# Altium schematic sheet 08.SchDoc
size 246 x 182 mm
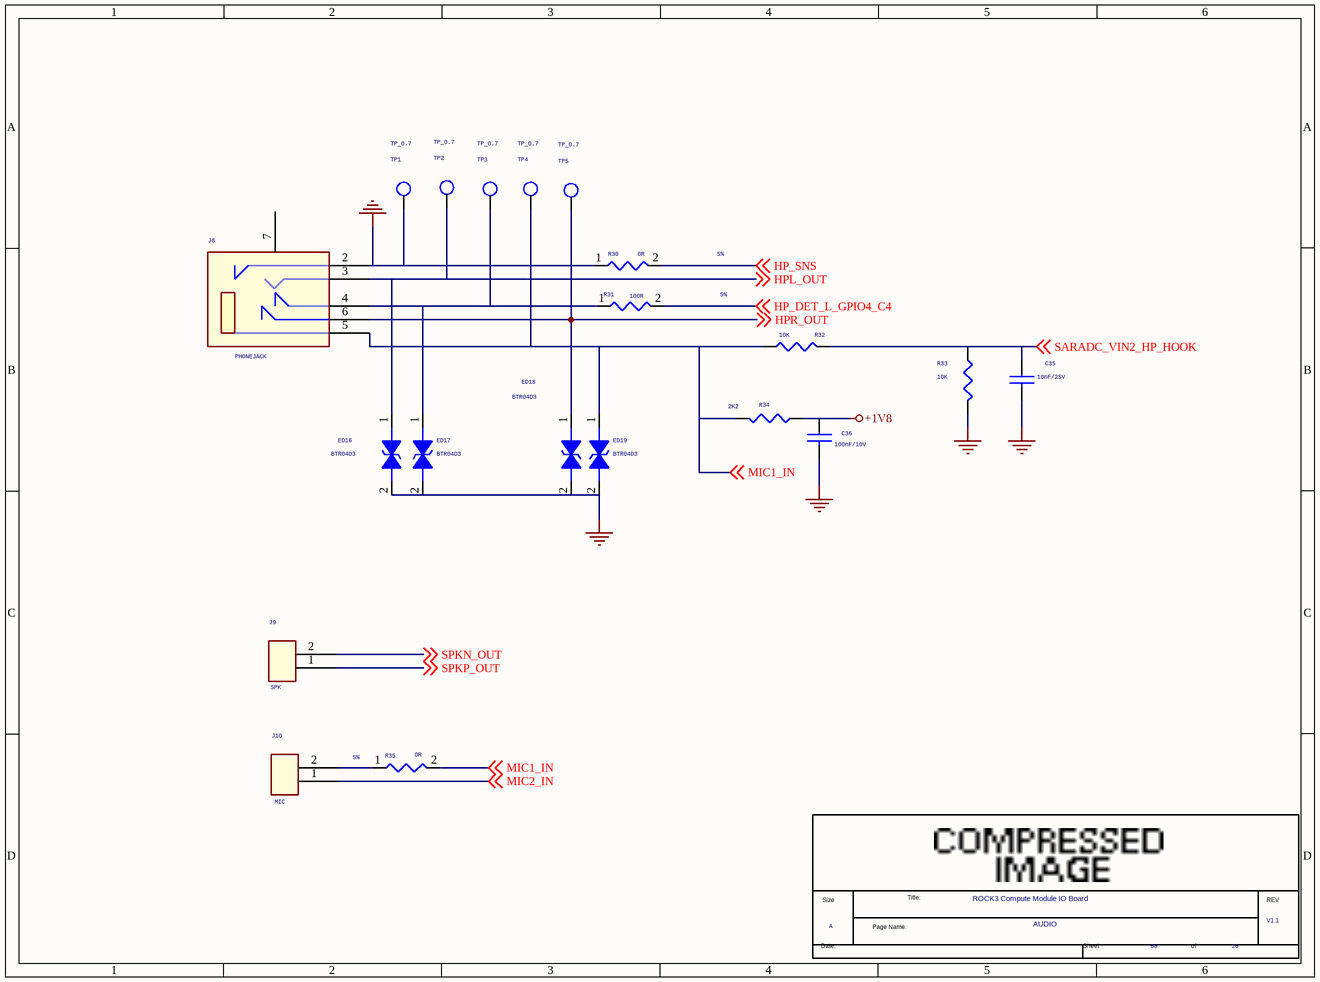
[diagram p0: 08.SchDoc]

## Parts
*  Page Count: 20  Page Number: 08  Page Size: A  Title: ROCK3 Compute Module IO Board  RevCode: V1.1  Doc: AUDIO  (hidden comment: radxa_gong)  (graphical)
C35  10nF/25V  [C0402]
C36  100nF/10V  [C0402]
ED16  BTR04D3  [ESD0402_1xD5]
ED17  BTR04D3  [ESD0402_1xD5]
ED18  BTR04D3  [ESD0402_1xD5]
ED19  BTR04D3  [ESD0402_1xD5]
J8  PHONEJACK  [PJ-327A]
J9  SPK  [DIP2PIN-2P54MM]
J10  MIC  [DIP2PIN-2P54MM]
R30  0R  Tolerance: 5%  [R0402]
R31  100R  Tolerance: 5%  [R0402]
R32  10K  [R0402]
R33  10K  [R0402]
R34  2K2  [R0402]
R35  0R  Tolerance: 5%  [R0402]
TP1  TP_0.7  [TEST]
TP2  TP_0.7  [TEST]
TP3  TP_0.7  [TEST]
TP4  TP_0.7  [TEST]
TP5  TP_0.7  [TEST]

## Nets
+1V8: C36.1 R34.2
GND: C35.2 C36.2 ED16.2 ED17.2 ED18.2 ED19.2 J8.2(DH) R30.1 R33.1 TP1.1
HP_DET_L_GPIO4_C4: R31.2 ; off-sheet HP_DET_L_GPIO4_C4
HP_SNS: R30.2 ; off-sheet HP_SNS
HPL_OUT: ED16.1 J8.3(R) TP2.1 ; off-sheet HPL_OUT
HPR_OUT: ED18.1 J8.6(HP) TP5.1 ; off-sheet HPR_OUT
MIC1_IN: ED19.1 J8.5(D) R32.2 R34.1 R35.2 TP4.1 ; off-sheet MIC1_IN
MIC2_IN: J10.1 ; off-sheet MIC2_IN
SARADC_VIN2_HP_HOOK: C35.1 R32.1 R33.2 ; off-sheet SARADC_VIN2_HP_HOOK
SPKN_OUT: J9.2 ; off-sheet SPKN_OUT
SPKP_OUT: J9.1 ; off-sheet SPKP_OUT
NetED17_1: ED17.1 J8.4(L) R31.1 TP3.1
NetJ10_2: J10.2 R35.1

Not connected (* = marked no-connect by the designer): J8 7(NC2)

## Notes on the sheet
- (in symbol radxa_gong) Size; Title:; REV; Page Name:; Date:; Sheet; of

## Library data of the parts
C35 = CAP: RoHS CHIP CAP 0.01uF +10/-10% X7R
C36 = CAP: RoHS CHIP CAP 0.1uF +10/-10% X7R
ED16 ED18 = DIODE BI_DIR TRIG: 1-Line, Bi-directional, Transient Voltage Suppressors.17.5pF.; Manufacturer PN: ESD5451N; Manufacturer: WillSemi(韦尔半导体); Priority: A; Created by: JJJ; Part Type: ESD_TVS; RK PN: ESD5451N
ED17 ED19 = DIODE BI_DIR TRIG: 1-Line, Bi-directional, Transient Voltage Suppressors.17.5pF.; Manufacturer: WillSemi(韦尔半导体); RK PN: ESD5451N; Priority: A; Part Type: ESD_TVS; Manufacturer PN: ESD5451N; Created by: JJJ
J8 = PHONEJACK STEREO SW_0: 耳插; BOM_TYPE: 60; BOM_VALUE: 0
J9 J10 = CON2
R30 R35 = RESISTOR_Dup1: 通用厚膜电阻,0R,+/-5%,R0402,1/16W.; Manufacturer: YAGEO; RK PN: RC0402JR-070RL; Priority: A; Wattage: 1/16W; Part Type: 通用厚膜电阻; Manufacturer PN: RC0402JR-070RL; Created by: YTL
R31 = RESISTOR_Dup1: 通用厚膜电阻,0R,+/-5%,R0402,1/16W.; Manufacturer PN: RC0402JR-070RL; Manufacturer: YAGEO; Wattage: 1/16W; Priority: A; Created by: YTL; Part Type: 通用厚膜电阻; RK PN: RC0402JR-070RL
R32 R33 = RESISTOR: ROHS CHIP RES 0R 1/16W 5%
R34 = RESISTOR: ROHS CHIP RES 2K2 1/16W 5%
TP1 TP3 TP5 = TP: Test Point 0.7mm; RK PN: TESTPOINT_0R7; Priority: A; Part Type: TP; Created by: JJJ
TP2 TP4 = TP: Test Point 0.7mm; Priority: A; RK PN: TESTPOINT_0R7; Created by: JJJ; Part Type: TP
* = radxa_gong: Page Create Date: March  8, 1995